# EAGLE design Environment-ArduinoNano44-Mini-Enclosure-V10-CustomBottoms (EAGLE 7.4.0)
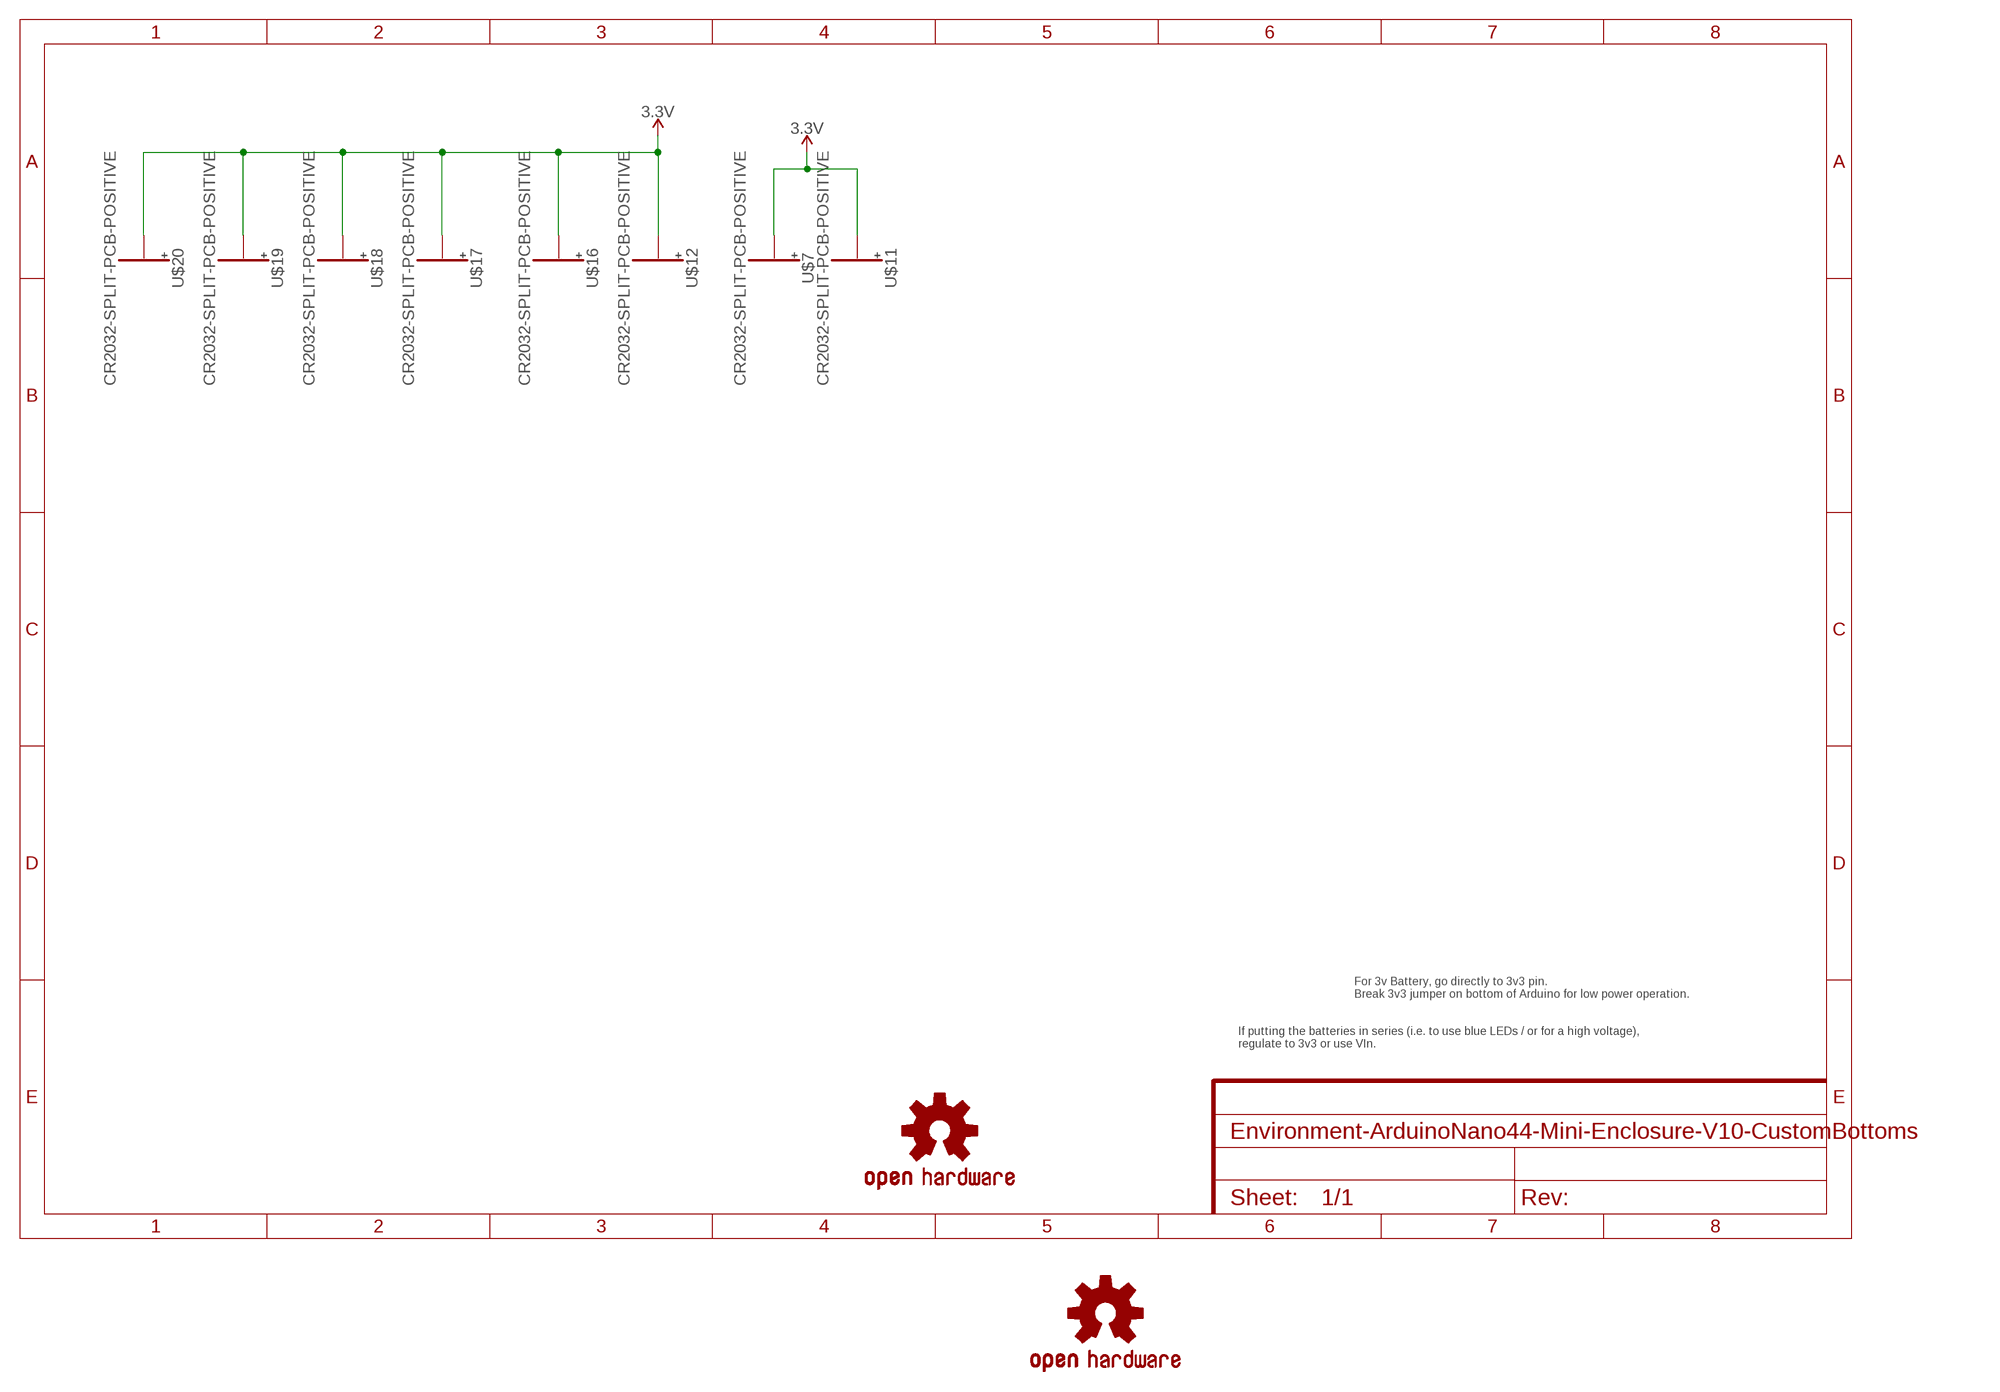
[diagram p0: schematic, sheet 1]

## Parts
LOGO2  OSHW-LOGOL  [OSHW-LOGO-L]
LOGO7  OSHW-LOGOM  [OSHW-LOGO-M]
U$7  CR2032-SPLIT-PCB-POSITIVE  [CR2032-SMD-POSITIVE-TERMINAL]
U$11  CR2032-SPLIT-PCB-POSITIVE  [CR2032-SMD-POSITIVE-TERMINAL]
U$12  CR2032-SPLIT-PCB-POSITIVE  [CR2032-SMD-POSITIVE-TERMINAL]
U$16  CR2032-SPLIT-PCB-POSITIVE  [CR2032-SMD-POSITIVE-TERMINAL]
U$17  CR2032-SPLIT-PCB-POSITIVE  [CR2032-SMD-POSITIVE-TERMINAL]
U$18  CR2032-SPLIT-PCB-POSITIVE  [CR2032-SMD-POSITIVE-TERMINAL]
U$19  CR2032-SPLIT-PCB-POSITIVE  [CR2032-SMD-POSITIVE-TERMINAL]
U$20  CR2032-SPLIT-PCB-POSITIVE  [CR2032-SMD-POSITIVE-TERMINAL]

## Nets
3.3V: U$7.+ U$11.+ U$12.+ U$16.+ U$17.+ U$18.+ U$19.+ U$20.+

## Notes on the sheet
- For 3v Battery, go directly to 3v3 pin.
  Break 3v3 jumper on bottom of Arduino for low power operation.
- If putting the batteries in series (i.e. to use blue LEDs / or for a high voltage), 
  regulate to 3v3 or use VIn.

## Library data of the parts
LOGO2 LOGO7 = SparkFun-Aesthetics:OSHW-LOGO: Open-Source Hardware (OSHW) Logo This logo indicates the piece of hardware it is found on incorporates a OSHW license and/or adheres to the definition of open source hardware found here: http://freedomdefined.org/OSHW
U$7 U$11 U$12 U$16-U$20 = ThingySticks:CR2032-SPLIT-PCB-POSITIVE

## Board
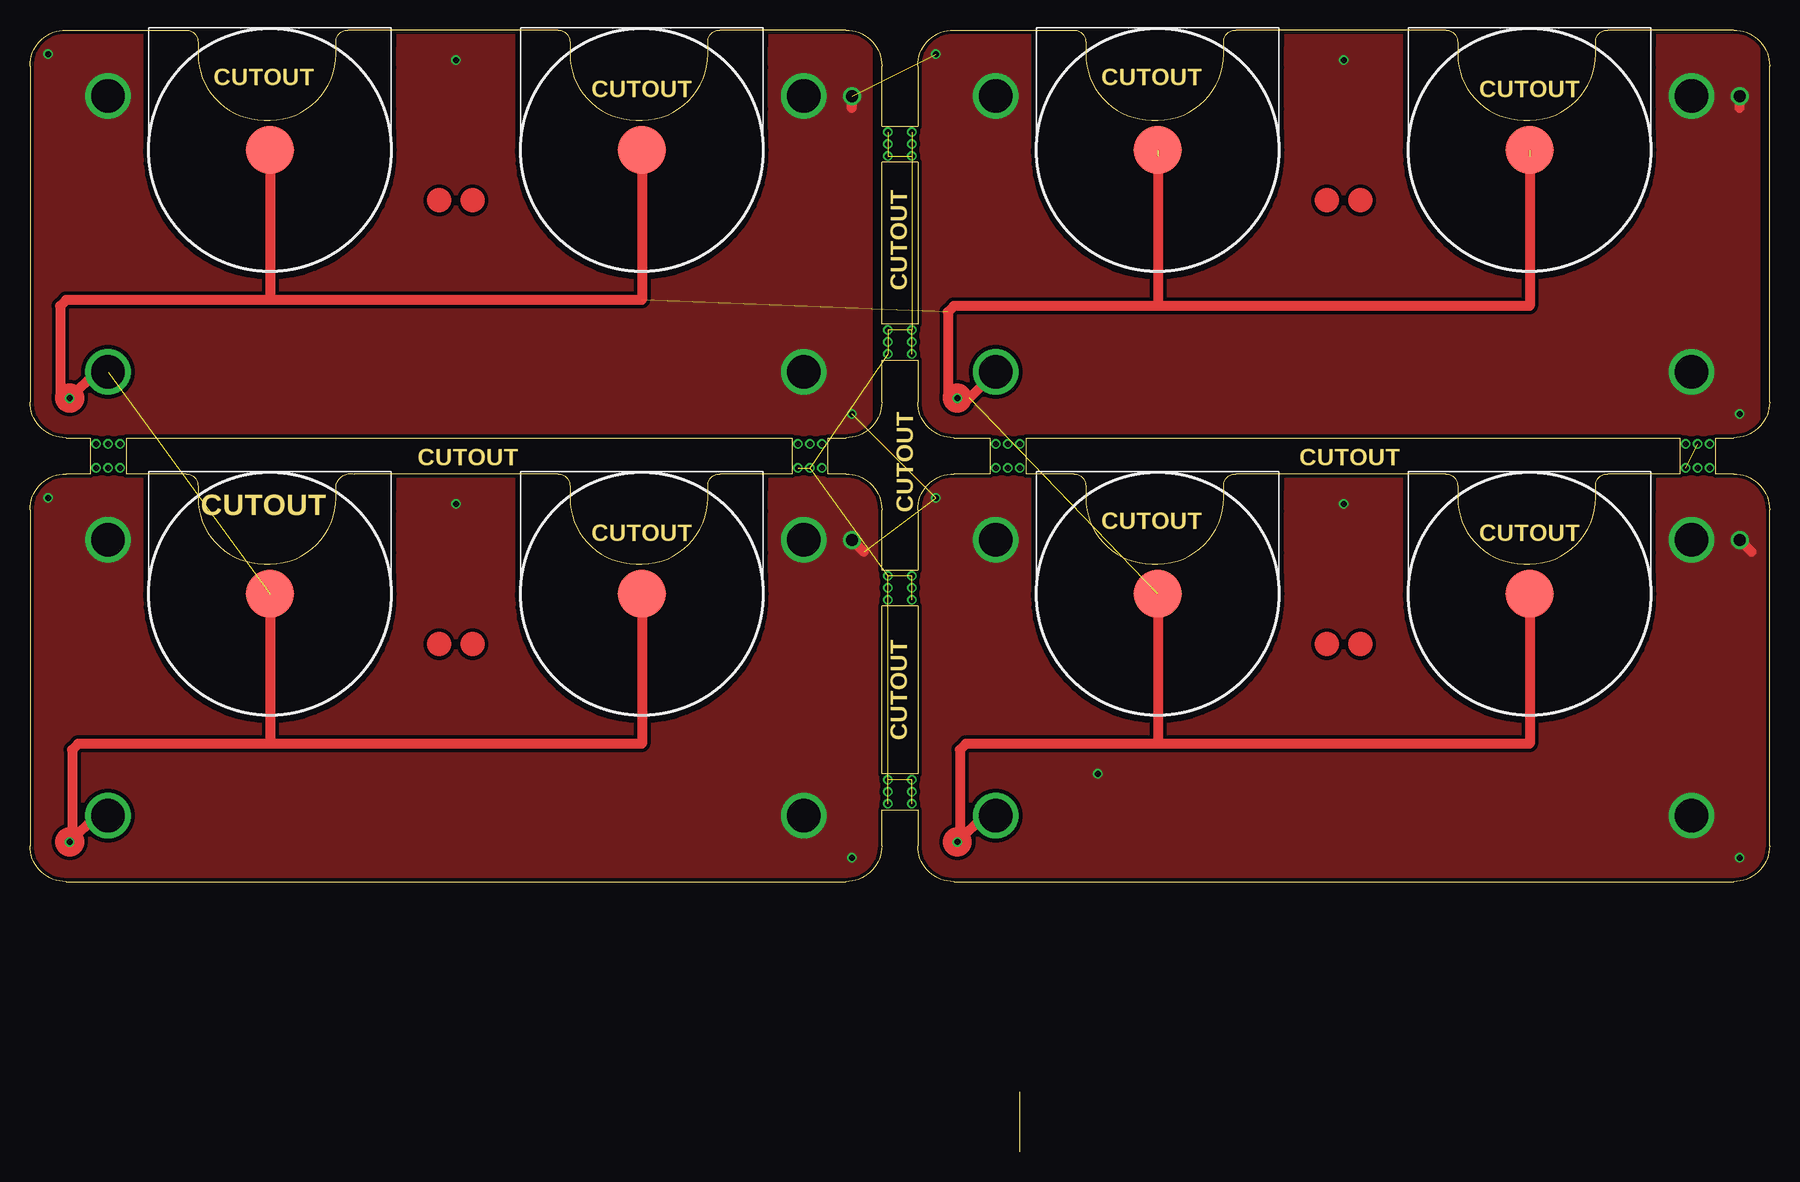
[diagram p1: board, top side]
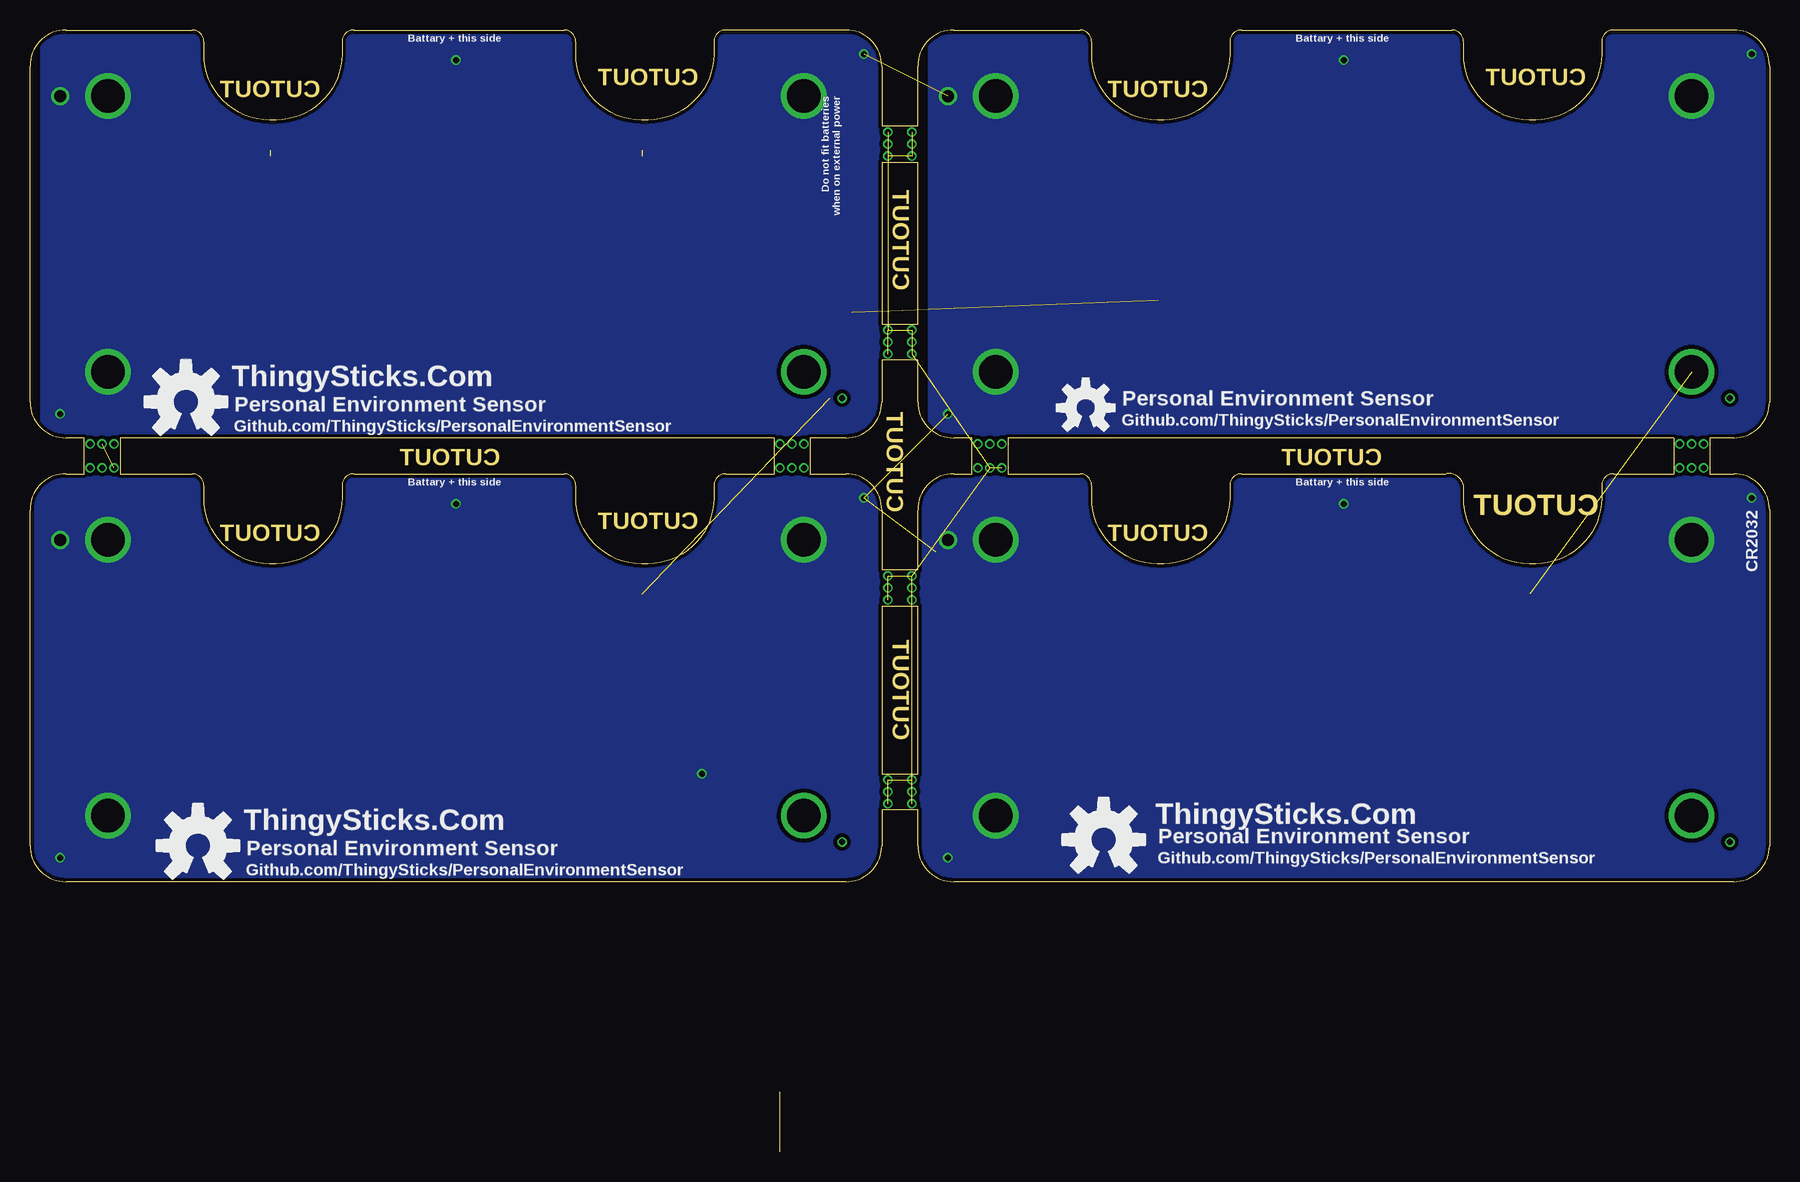
[diagram p2: board, bottom side, seen from below]

Size 145 x 93.5 mm. Coordinates in mm from the lower left corner, seen from the top.
Outline: 82.5,0 82.5,5
Outline: 102.5,93.5 118,93.5 arc-90 119,92.5 119,91.5 arc90 124.5,86 arc95 130.5,91.5 130.5,92.5 arc-90 131.5,93.5 142,93.5 arc-90 145,90.5 145,62.5 arc-90 142,59.5 140.5,59.5 140.5,56.5 142,56.5 arc-90 145,53.5 145,25.5 arc-90 142,22.5 77,22.5 arc-90 74,25.5 74,28.5 71,28.5 71,25.5 arc-90 68,22.5 3,22.5 arc-90 0,25.5 0,53.5 arc-90 3,56.5 5,56.5 5,59.5 3,59.5 arc-90 0,62.5 0,90.5 arc-90 3,93.5 13,93.5 arc-90 14,92.5 14,91.5 arc90 19.5,86 arc95 25.5,91.5 25.5,92.5 arc-90 26.5,93.5 37,93.5
Outline: 111,93.5 100.5,93.5 arc90 99.5,92.5 99.5,91.5 arc-95 93.5,86 arc-90 88,91.5 88,92.5 arc90 87,93.5 77,93.5 arc90 74,90.5 74,85.5 71,85.5 71,90.5 arc90 68,93.5 57.5,93.5 arc90 56.5,92.5 56.5,91.5 arc-95 50.5,86 arc-90 45,91.5 45,92.5 arc90 44,93.5 28.5,93.5
Outline: 71,31.5 71,45.5 74,45.5 74,31.5 71,31.5
Outline: 71,48.5 71,53.5 arc90 68,56.5 66.5,56.5 66.5,59.5 68,59.5 arc90 71,62.5 71,66 74,66 74,62.5 arc90 77,59.5 80,59.5 80,56.5 77,56.5 arc90 74,53.5 74,48.5 71,48.5
Outline: 44,56.5 27,56.5 arc90 25.5,55.5 25.5,54.5 arc-95 19.5,49 arc-90 14,54.5 14,55.5 arc90 13,56.5 8,56.5 8,59.5 63.5,59.5 63.5,56.5 57.5,56.5 arc90 56.5,55.5 56.5,54.5 arc-95 50.5,49 arc-90 45,54.5 45,55.5 arc90 44,56.5
Outline: 71,69 71,82.5 74,82.5 74,69 71,69
Outline: 118,56.5 100.5,56.5 arc90 99.5,55.5 99.5,54.5 arc-95 93.5,49 arc-90 88,54.5 88,55.5 arc90 87,56.5 83,56.5 83,59.5 137.5,59.5 137.5,56.5 131.5,56.5 arc90 130.5,55.5 130.5,54.5 arc-95 124.5,49 arc-90 119,54.5 119,55.5 arc90 118,56.5
Copper layers (1*16): Top 0.035mm / dielectric 1.5mm / Bottom 0.035mm
Design rules "dirt_cheap_dirty_boards.v1.1": minimum track width 6mil, minimum drill 12mil, track to track 6mil, track to pad 6mil, pad to pad 6mil, via to via 6mil, smd to smd 0mil, copper to edge 10mil, drill to drill 10mil, minimum pad ring 10mil, minimum via ring 6mil, stop-mask expansion 2mil, vias tented up to drill 25mil, thermal gap 10mil
bKeepout: area 41,36.5 to 61,56.5; area 10,36.5 to 30,56.5; area 41,73.5 to 61,93.5; area 10,73.5 to 30,93.5; area 115,36.5 to 135,56.5; area 84,36.5 to 104,56.5; area 115,73.5 to 135,93.5; area 84,73.5 to 104,93.5
tRestrict: area 10,36.5 to 30,56.5; area 41,36.5 to 61,56.5; area 10,73.5 to 30,93.5; area 41,73.5 to 61,93.5; area 84,36.5 to 104,56.5; area 115,36.5 to 135,56.5; area 84,73.5 to 104,93.5; area 115,73.5 to 135,93.5

### Footprints (pad centres in the part's own frame; a part is rotated, then mirrored left to right if it is on the bottom)
CR2032-SMD-POSITIVE-TERMINAL = smd 4 x 4 bottom: + 0,0

### Placement (x,y rotation side)
LOGO2  55.5,26 0 bottom
LOGO5  OSHW-LOGOL  [OSHW-LOGO-L]  131,25.5 0 bottom
LOGO6  OSHW-LOGOL  [OSHW-LOGO-L]  132,62.5 0 bottom
LOGO7  57,62 0 bottom
U$7  20,46.5 0 bottom
U$11  51,46.5 0 bottom
U$12  20,83.5 0 bottom
U$16  51,83.5 0 bottom
U$17  94,83.5 0 bottom
U$18  125,83.5 0 bottom
U$19  94,46.5 0 bottom
U$20  125,46.5 0 bottom

### Tracks (layer width: path | path; a pad name or v marks a point on that pad's centre or on a via)
3.3V  (via drill 0.5, 2.8)  (5 unrouted)
  Top 0.305: U$7.+ 20,43.5 | U$11.+ 51,43.5
  Top 0.406: 3.5,26 v3.3,25.8 | 77.5,26 v77.3,25.8
  Top 0.813: U$11.+ 51,34 20,34 | 20,34 4,34 3.5,33.5 3.5,26 | U$7.+ 20,34 | U$16.+ 51,71 20,71 | 20,71 3,71 2.5,70.5 2.5,63 v3.3,62.8 5.5,65 v6.5,65 | U$12.+ 20,71 | 125,83 125,70.5 94,70.5 | 94,70.5 77,70.5 76.5,70 76.5,63 v77.3,62.8 78.3,62.8 v80.5,65 | 94,83 94,70.5 | U$20.+ 125,34 94,34 | 94,34 78,34 77.5,33.5 77.5,26 | U$19.+ 94,34 | v6.5,28 5.5,28 v3.3,25.8 | v80.5,28 79.5,28 v77.3,25.8
GND  (via drill 0.5, 1, 2.8)  (3 unrouted)
  Top 0.813: 68.5,87 v68.5,88 | 69.5,50 v68.5,51 | 143.5,50 v142.5,51 | 142.5,87 v142.5,88
  other vias: 64.5,28 64.5,51 64.5,65 64.5,88 80.5,88 138.5,88 138.5,65 138.5,51 138.5,28 6.5,51 6.5,88 80.5,51 1.5,91.5 68.5,61.5 35.5,91 109.5,91 35.5,54 109.5,54 1.5,54.5 68.5,24.5 75.5,54.5 142.5,24.5 75.5,91.5 142.5,61.5 89,31.5
  pour Bottom (isolate 0.305, rank 4): -1,93.5 70,93.5 70,59.5 -1,59.5
  pour Top (isolate 0.305, rank 4): -1,93.5 70,93.5 70,59.5 -1,59.5
  pour Bottom (isolate 0.305, rank 4): 0,56.5 71,56.5 71,22.5 0,22.5
  pour Top (isolate 0.305, rank 4): 0,56.5 71,56.5 71,22.5 0,22.5
  pour Bottom (isolate 0.305, rank 4): 74,56.5 145,56.5 145,22.5 74,22.5
  pour Top (isolate 0.305, rank 4): 74,56.5 145,56.5 145,22.5 74,22.5
  pour Bottom (isolate 0.305, rank 4): 73,93.5 144,93.5 144,59.5 73,59.5
  pour Top (isolate 0.305, rank 4): 73,93.5 144,93.5 144,59.5 73,59.5
N$50  (via drill 0.5)
  other vias: 65,59
N$51  (via drill 0.5)  (25 unrouted)
  other vias: 65,57 64,57 71.5,66.5 71.5,67.5 71.5,68.5 73.5,68.5 73.5,67.5 73.5,66.5 71.5,48 73.5,83 71.5,83 71.5,84 71.5,85 73.5,85 73.5,84 73.5,48 73.5,47 71.5,47 71.5,46 73.5,46 71.5,31 73.5,31 73.5,30 71.5,30 71.5,29 73.5,29
N$52  (via drill 0.5)
  other vias: 66,57
N$53  (via drill 0.5)
  other vias: 7.5,57
N$54  (via drill 0.5)
  other vias: 6.5,57
N$55  (via drill 0.5)
  other vias: 5.5,57
N$57  (via drill 0.5)
  other vias: 7.5,59
N$58  (via drill 0.5)
  other vias: 5.5,59
N$59  (via drill 0.5)
  other vias: 6.5,59
N$60  (via drill 0.5)
  other vias: 64,59
N$61  (via drill 0.5)
  other vias: 66,59
N$72  (via drill 0.5)  (1 unrouted)
  other vias: 139,59 138,57
N$73  (via drill 0.5)
  other vias: 139,57
N$74  (via drill 0.5)
  other vias: 140,57
N$75  (via drill 0.5)
  other vias: 81.5,57
N$76  (via drill 0.5)
  other vias: 80.5,57
N$77  (via drill 0.5)
  other vias: 82.5,57
N$78  (via drill 0.5)
  other vias: 82.5,59
N$79  (via drill 0.5)
  other vias: 81.5,59
N$80  (via drill 0.5)
  other vias: 80.5,59
N$81  (via drill 0.5)
  other vias: 138,59
N$82  (via drill 0.5)
  other vias: 140,59
(copper drawn outside any net)
  shapes: Top circle x12

### Text on the board
Dimension: CUTOUT | CUTOUT | CUTOUT | CUTOUT | CUTOUT | CUTOUT | CUTOUT | CUTOUT | CUTOUT | CUTOUT | CUTOUT | CUTOUT | CUTOUT
bNames: Battary + this side | Battary + this side | Do not fit batteries / when on external power | ThingySticks.Com | Personal Environment Sensor | Personal Environment Sensor | Github.com/ThingySticks/PersonalEnvironmentSensor | Github.com/ThingySticks/PersonalEnvironmentSensor | Battary + this side | Battary + this side | CR2032 | ThingySticks.Com | ThingySticks.Com | Personal Environment Sensor | Github.com/ThingySticks/PersonalEnvironmentSensor | Personal Environment Sensor | Github.com/ThingySticks/PersonalEnvironmentSensor
tValues: Dan / SmartSpaces / Custom Name Base | Chris / Custom Name Base | ThingySticks / Custom Name Base | ThingySticks / Custom Name Base
bStop: Dan | Chris | SmartSpaces | ThingySticks | Wilson
Document: Top PCB has pads on solder side / for batteyr -VE connection
Reference: 1mm PCB | Bottom PCB | 1mm PCB | Bottom PCB
tDocu: NFC Pads | NFC Pads | NFC Pads | NFC Pads